# Altium project Nebula.PrjPcb
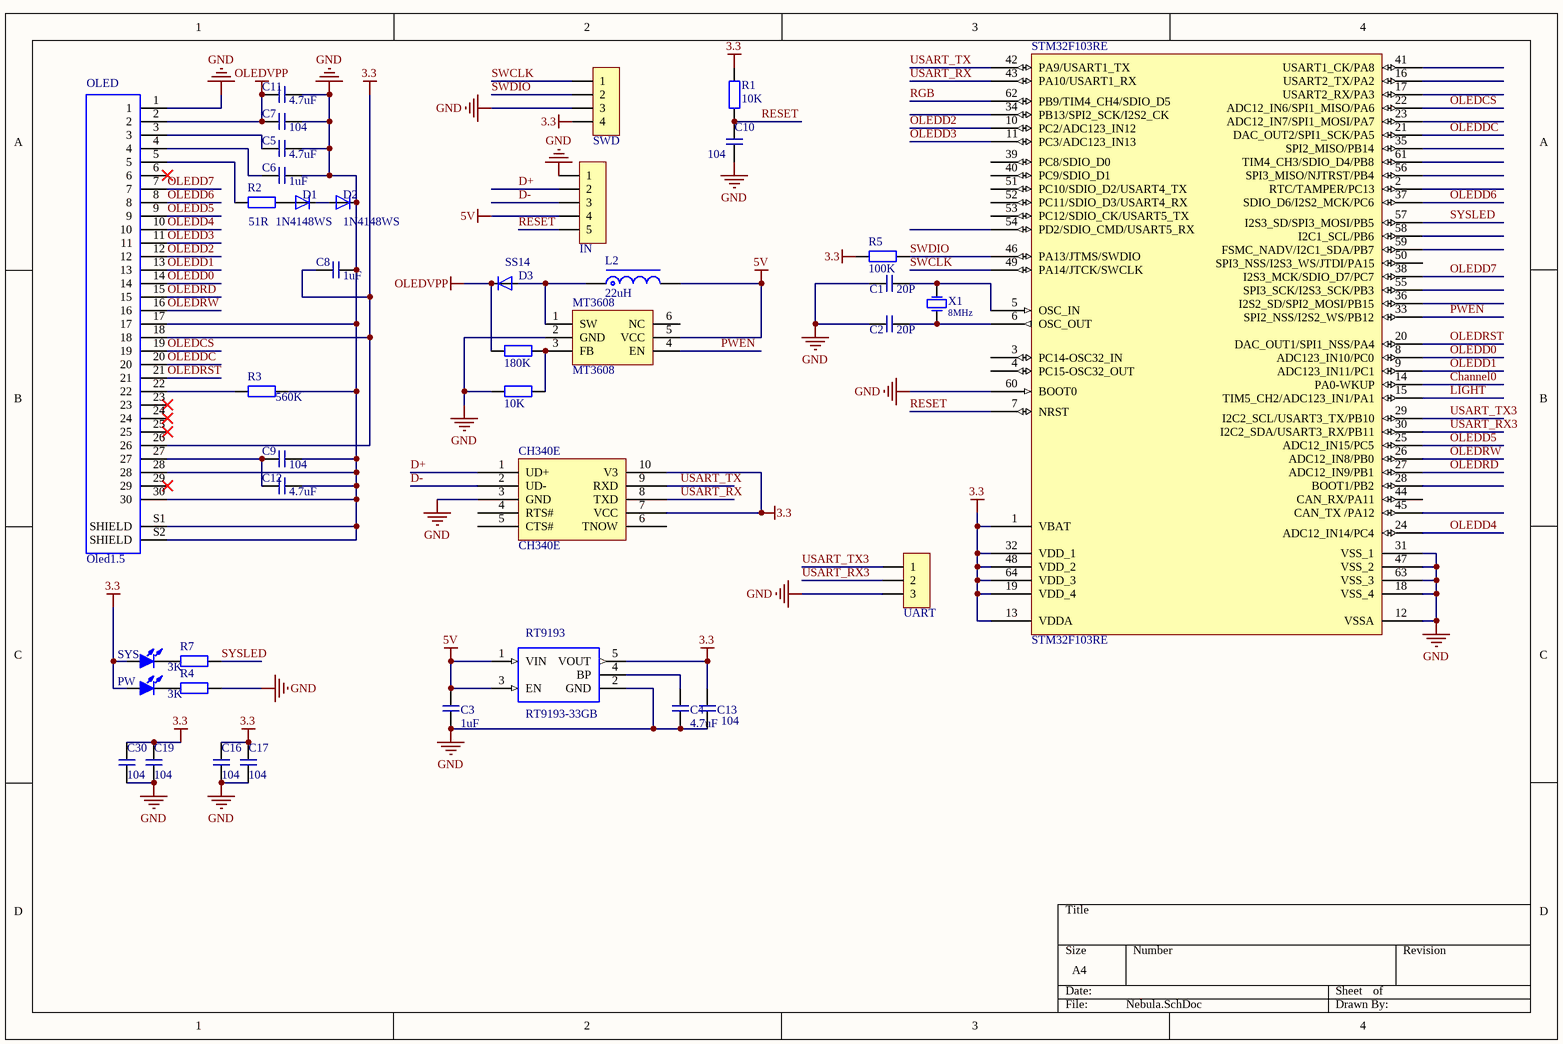
[diagram p0: Nebula.SchDoc]
1 sheet, 40 parts. Net scope: global (net labels, ports and power ports of the same name join across sheets).
Board file: Nebula.PcbDoc

## Sheet Nebula.SchDoc
size A4

### Parts
C1  20P  [0603C]
C2  20P  [0603C]
C3  1uF  [0603C]
C4  4.7uF  [0603C]
C5  4.7uF  [0603C]
C6  1uF  [0603C]
C7  104  [0603C]
C8  1uF  [0603C]
C9  104  [0603C]
C10  104  [0603C]
C11  4.7uF  [0603C]
C12  4.7uF  [0603C]
C13  104  [0603C]
C16  104  [0603C]
C17  104  [0603C]
C19  104  [0603C]
C30  104  [0603C]
CH340E  CH340E  [MSOP10_L]
D1  1N4148WS  [SOD323_1N4148WS]
D2  1N4148WS  [SOD323_1N4148WS]
D3  SS14  [SOD323_1N4148WS]
IN  HDR-1X5  [ZH1.5-LS-5P]  (value not drawn)
L2  22uH  [1210-ec]
MT3608  MT3608  [SOT23-6N]
OLED  Oled1.5  [PCBComponent_1]
PW  白色  [0603LED]  (value not drawn)
R1  10K  [0603R]
R2  51R  [0603R]
R3  560K  [0603R]
R4  3K  [0603R]
R5  100K  [0603R]
R7  3K  [0603R]
RB  180K  [0603R]
RS  10K  [0603R]
RT9193  RT9193-33GB  [sot23-5]
STM32F103RE  STM32F103RE  [LQFP64 10X10_N]
SWD  HDR-1X4  [ZH1.5-LS-4P]  (value not drawn)
SYS  粉色  [0603LED]  (value not drawn)
UART  HDR-1X3  [ZH1.5-LS-3P]  (value not drawn)
X1  value 8MHz  [OSC 5032-2P]  (hidden comment: 1.6.1.01.005.001)

### Nets
3.3: C8.1 C13.2 C16.1 C17.1 C19.1 C30.1 CH340E.7(VCC) CH340E.10(V3) OLED.18 OLED.26 PW.1(A) R1.1 R5.1 RT9193.5(VOUT) STM32F103RE.1(VBAT) STM32F103RE.13(VDDA) STM32F103RE.19(VDD_4) STM32F103RE.32(VDD_1) STM32F103RE.48(VDD_2) STM32F103RE.64(VDD_3) SWD.4 SYS.1(A)
5V: C3.2 IN.4 L2.2 MT3608.5(VCC) RT9193.1(VIN) RT9193.3(EN)
GND: C1.1 C2.1 C3.1 C4.1 C5.2 C6.2 C7.2 C8.2 C9.2 C10.2 C11.2 C12.2 C13.1 C16.2 C17.2 C19.2 C30.2 CH340E.3(GND) D2.C IN.1 MT3608.2(GND) OLED.1 OLED.17 OLED.28 OLED.30 OLED.S1(SHIELD) OLED.S2(SHIELD) R3.1 R4.1 RS.1 RT9193.2(GND) STM32F103RE.12(VSSA) STM32F103RE.18(VSS_4) STM32F103RE.31(VSS_1) STM32F103RE.47(VSS_2) STM32F103RE.60(BOOT0) STM32F103RE.63(VSS_3) SWD.3 UART.3
OLEDVPP: C7.1 C11.1 D3.C OLED.2 RB.1
Channel0: STM32F103RE.14(PA0-WKUP)
D+: CH340E.1(UD+) IN.2
D-: CH340E.2(UD-) IN.3
LIGHT: STM32F103RE.15(TIM5_CH2/ADC123_IN1/PA1)
OLEDCS: OLED.19 STM32F103RE.22(ADC12_IN6/SPI1_MISO/PA6)
OLEDD0: OLED.14 STM32F103RE.8(ADC123_IN10/PC0)
OLEDD1: OLED.13 STM32F103RE.9(ADC123_IN11/PC1)
OLEDD2: OLED.12 STM32F103RE.10(PC2/ADC123_IN12)
OLEDD3: OLED.11 STM32F103RE.11(PC3/ADC123_IN13)
OLEDD4: OLED.10 STM32F103RE.24(ADC12_IN14/PC4)
OLEDD5: OLED.9 STM32F103RE.25(ADC12_IN15/PC5)
OLEDD6: OLED.8 STM32F103RE.37(SDIO_D6/I2S2_MCK/PC6)
OLEDD7: OLED.7 STM32F103RE.38(I2S3_MCK/SDIO_D7/PC7)
OLEDDC: OLED.20 STM32F103RE.21(DAC_OUT2/SPI1_SCK/PA5)
OLEDRD: OLED.15 STM32F103RE.27(ADC12_IN9/PB1)
OLEDRST: OLED.21 STM32F103RE.20(DAC_OUT1/SPI1_NSS/PA4)
OLEDRW: OLED.16 STM32F103RE.26(ADC12_IN8/PB0)
PWEN: MT3608.4(EN) STM32F103RE.33(SPI2_NSS/I2S2_WS/PB12)
RESET: C10.1 IN.5 R1.2 STM32F103RE.7(NRST)
RGB: STM32F103RE.62(PB9/TIM4_CH4/SDIO_D5)
SWCLK: STM32F103RE.49(PA14/JTCK/SWCLK) SWD.1
SWDIO: R5.2 STM32F103RE.46(PA13/JTMS/SWDIO) SWD.2
SYSLED: R7.1 STM32F103RE.57(I2S3_SD/SPI3_MOSI/PB5)
USART_RX: CH340E.8(TXD) STM32F103RE.43(PA10/USART1_RX)
USART_RX3: STM32F103RE.30(I2C2_SDA/USART3_RX/PB11) UART.2
USART_TX: CH340E.9(RXD) STM32F103RE.42(PA9/USART1_TX)
USART_TX3: STM32F103RE.29(I2C2_SCL/USART3_TX/PB10) UART.1
NetC1_2: C1.2 STM32F103RE.5(OSC_IN) X1.2(OSC2)
NetC2_2: C2.2 STM32F103RE.6(OSC_OUT) X1.1(OSC1)
NetC4_2: C4.2 RT9193.4(BP)
NetC5_1: C5.1 OLED.3
NetC6_1: C6.1 OLED.4
NetC9_1: C9.1 C12.1 OLED.27
NetD1_A: D1.A R2.1
NetD1_C: D1.C D2.A
NetD3_A: D3.A L2.1 MT3608.1(SW)
NetMT3608_3: MT3608.3(FB) RB.2 RS.2
NetOLED_5: OLED.5 R2.2
NetOLED_22: OLED.22 R3.2
NetPW_2: PW.2(K) R4.2
NetR7_2: R7.2 SYS.2(K)

Not connected (* = marked no-connect by the designer): CH340E 4(RTS#) 5(CTS#) 6(TNOW); MT3608 6(NC); OLED 6* 23* 24* 25* 29*; STM32F103RE 2(RTC/TAMPER/PC13) 3(PC14-OSC32_IN) 4(PC15-OSC32_OUT) 16(USART2_TX/PA2) 17(USART2_RX/PA3) 23(ADC12_IN7/SPI1_MOSI/PA7) 28(BOOT1/PB2) 34(PB13/SPI2_SCK/I2S2_CK) 35(SPI2_MISO/PB14) 36(I2S2_SD/SPI2_MOSI/PB15) 39(PC8/SDIO_D0) 40(PC9/SDIO_D1) 41(USART1_CK/PA8) 44(CAN_RX/PA11) 45(CAN_TX_/PA12) 50(SPI3_NSS/I2S3_WS/JTDI/PA15) 51(PC10/SDIO_D2/USART4_TX) 52(PC11/SDIO_D3/USART4_RX) 53(PC12/SDIO_CK/USART5_TX) 54(PD2/SDIO_CMD/USART5_RX) 55(SPI3_SCK/I2S3_SCK/PB3) 56(SPI3_MISO/NJTRST/PB4) 58(I2C1_SCL/PB6) 59(FSMC_NADV/I2C1_SDA/PB7) 61(TIM4_CH3/SDIO_D4/PB8)

### Library data of the parts
C1-C13 C16 C17 C19 C30 = 电容
D1-D3 = 1N4148WS: Diode Switching 75V 0.3A 2-Pin SOD-323 T/R; MF: ON Semiconductor; SnapEDA_Link: https://www.snapeda.com/parts/1N4148WS/ON%20Semiconductor/view-part/?ref=snap; Price: None; Availability: Unavailable; MP: 1N4148WS; Package: S-0 Good-Ark; Value: *
IN = Header 5: 5P接插件; 版权归属: 源创客; BOM名称: 5P接插件; 学习资源: www.ooocke.com
L2 = L-CDRH: 功率屏蔽电感; 版权归属: 源创客; BOM名称: 功率屏蔽电感; 学习资源: www.ooocke.com
MT3608 = SX1308: 可调升压芯片; 版权归属: 源创客; BOM名称: 可调升压芯片; 学习资源: www.ooocke.com
OLED = FH12-30S-0.5SH(55): FH12 Series 30 Position 0.5 mm Pitch Surface Mount Right Angle Flip Lock FFC/FPC; pin to pad: 1>30 2>29 3>28 4>27 5>26 6>25 7>24 8>23 9>22 10>21 11>20 12>19 13>18 14>17 15>16 16>15 17>14 18>13 19>12 20>11 21>10 22>9 23>8 24>7 25>6 26>5 27>4 28>3 29>2 30>1; MF: Hirose Electric; MP: FH12-30S-0.5SH_55_; Package: None; Availability: Unavailable; SnapEDA_Link: https://www.snapeda.com/parts/FH12-30S-0.5SH%2855%29/Hirose%20Electric%20Co%20Ltd/view-part/?ref=snap; Price: None; Value: *
PW SYS = LED-F234: 方形LED; 版权归属: 源创客; BOM名称: 方形LED; 学习资源: www.ooocke.com
R1-R5 R7 RB RS = R: 贴片电阻; 版权归属: 源创客; BOM名称: 贴片电阻; 学习资源: www.ooocke.com
RT9193 = RT9193-33GB: RT9193 Series 300 mA 3.3 V Ultra-Low Noise Ultra-Fast CMOS LDO Regulator-SC-70-5; MF: Richtek USA; SnapEDA_Link: https://www.snapeda.com/parts/RT9193-33GB/Richtek%20USA%20Inc./view-part/?ref=snap; Price: None; Availability: Unavailable; Package: SOT-23-5 Richtek; MP: RT9193-33GB; Value: *
STM32F103RE = STM32F103RE: 32位STM单片机; 版权归属: 源创客; BOM名称: 32位STM单片机; 学习资源: www.ooocke.com
SWD = Header 4: 4P接插件; 版权归属: 源创客; BOM名称: 4P接插件; 学习资源: www.ooocke.com
UART = Header 3: 3P接插件; 版权归属: 源创客; BOM名称: 3P接插件; 学习资源: www.ooocke.com
X1 = 1.6.1.01.005.001: XTAL,8MHz,±20PPM,12.6*4.5; K3 No.: 1.6.1.01.005.001; GENERAL: *